# Altium schematic sheet Top.SchDoc
size A4
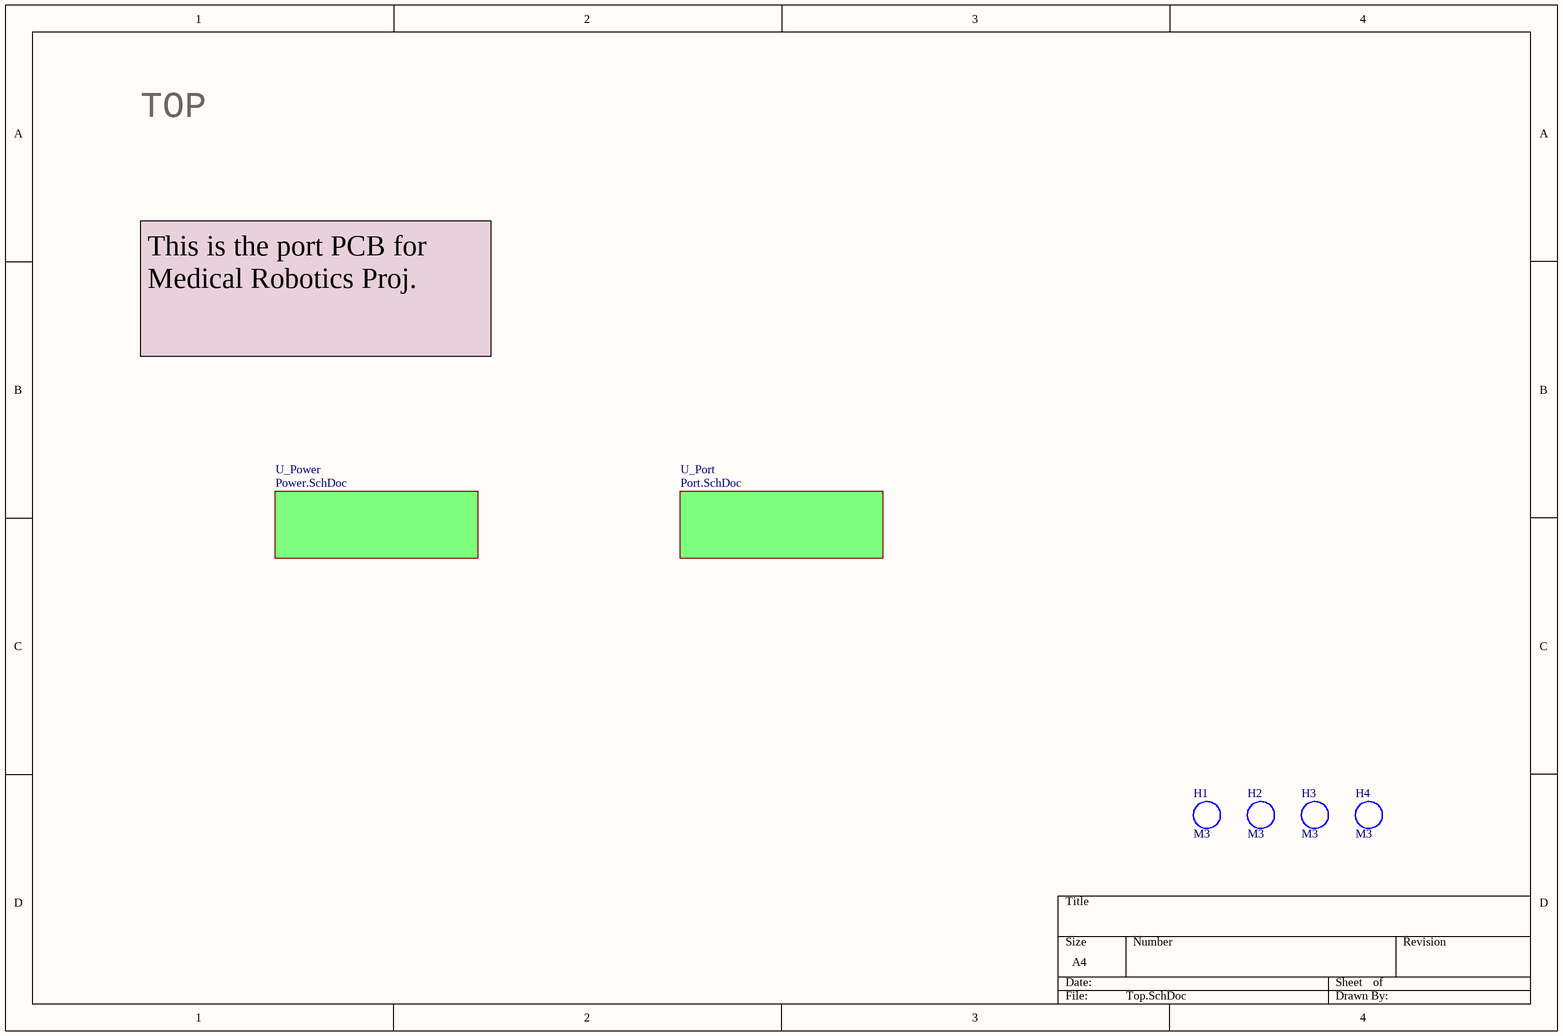
[diagram p0: Top.SchDoc]

## Parts
H1  M3  [M3_PTH-VIA]
H2  M3  [M3_PTH-VIA]
H3  M3  [M3_PTH-VIA]
H4  M3  [M3_PTH-VIA]

## Sub-sheets
U_Port = Port.SchDoc: no entries
U_Power = Power.SchDoc: no entries

## Notes on the sheet
- TOP
- This is the port PCB for
  Medical Robotics Proj.

## Library data of the parts
H1-H4 = PTH_via: Hole with copper